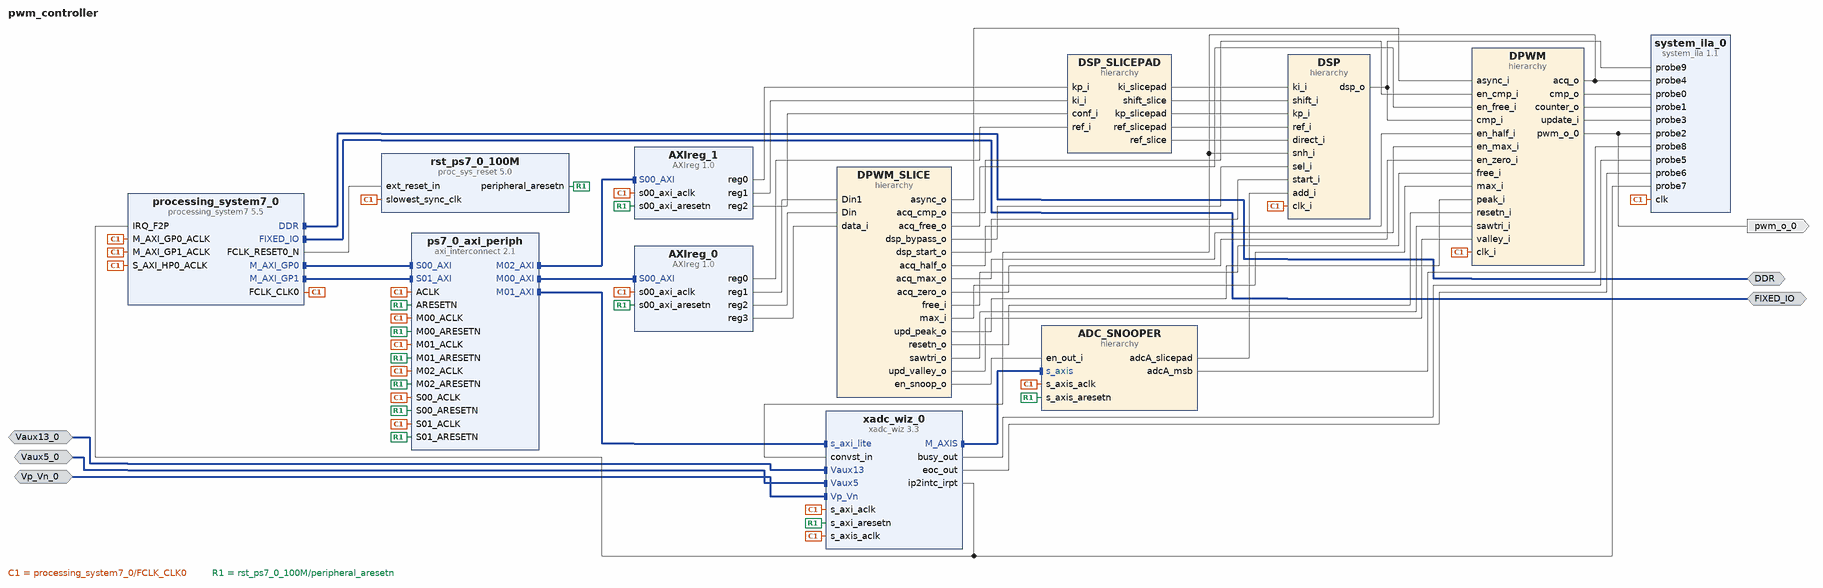
[diagram p0: block diagram of the top level]
# Vivado block design pwm_controller, xc7z020clg400-1, Vivado 2022.2
create_bd_design pwm_controller

create_bd_intf_port -mode Master -vlnv xilinx.com:interface:ddrx_rtl:1.0 DDR
create_bd_intf_port -mode Master -vlnv xilinx.com:display_processing_system7:fixedio_rtl:1.0 FIXED_IO
create_bd_intf_port -mode Slave -vlnv xilinx.com:interface:diff_analog_io_rtl:1.0 Vp_Vn_0
create_bd_intf_port -mode Slave -vlnv xilinx.com:interface:diff_analog_io_rtl:1.0 Vaux5_0
create_bd_intf_port -mode Slave -vlnv xilinx.com:interface:diff_analog_io_rtl:1.0 Vaux13_0
create_bd_port -dir O pwm_o_0

create_bd_cell -type ip -vlnv xilinx.com:ip:processing_system7:5.5 processing_system7_0
set_property -dict [list \
  CONFIG.PCW_APU_PERIPHERAL_FREQMHZ 650 \
  CONFIG.PCW_CRYSTAL_PERIPHERAL_FREQMHZ 50 \
  CONFIG.PCW_ENET0_ENET0_IO {MIO 16 .. 27} \
  CONFIG.PCW_ENET0_GRP_MDIO_ENABLE 1 \
  CONFIG.PCW_ENET0_GRP_MDIO_IO {MIO 52 .. 53} \
  CONFIG.PCW_ENET0_PERIPHERAL_ENABLE 1 \
  CONFIG.PCW_ENET0_RESET_ENABLE 1 \
  CONFIG.PCW_ENET0_RESET_IO {MIO 9} \
  CONFIG.PCW_ENET_RESET_ENABLE 1 \
  CONFIG.PCW_ENET_RESET_SELECT {Share reset pin} \
  CONFIG.PCW_FPGA0_PERIPHERAL_FREQMHZ 100 \
  CONFIG.PCW_FPGA1_PERIPHERAL_FREQMHZ 50 \
  CONFIG.PCW_GPIO_MIO_GPIO_ENABLE 1 \
  CONFIG.PCW_GPIO_MIO_GPIO_IO MIO \
  CONFIG.PCW_I2C_RESET_ENABLE 1 \
  CONFIG.PCW_IRQ_F2P_INTR 1 \
  CONFIG.PCW_M_AXI_GP0_FREQMHZ 10 \
  CONFIG.PCW_PERIPHERAL_BOARD_PRESET part0 \
  CONFIG.PCW_PRESET_BANK1_VOLTAGE {LVCMOS 1.8V} \
  CONFIG.PCW_QSPI_GRP_FBCLK_ENABLE 1 \
  CONFIG.PCW_QSPI_GRP_FBCLK_IO {MIO 8} \
  CONFIG.PCW_QSPI_GRP_SINGLE_SS_ENABLE 1 \
  CONFIG.PCW_QSPI_GRP_SINGLE_SS_IO {MIO 1 .. 6} \
  CONFIG.PCW_QSPI_PERIPHERAL_ENABLE 1 \
  CONFIG.PCW_QSPI_QSPI_IO {MIO 1 .. 6} \
  CONFIG.PCW_SD0_GRP_CD_ENABLE 1 \
  CONFIG.PCW_SD0_GRP_CD_IO {MIO 47} \
  CONFIG.PCW_SD0_GRP_WP_ENABLE 0 \
  CONFIG.PCW_SD0_PERIPHERAL_ENABLE 1 \
  CONFIG.PCW_SD0_SD0_IO {MIO 40 .. 45} \
  CONFIG.PCW_SDIO_PERIPHERAL_FREQMHZ 50 \
  CONFIG.PCW_SINGLE_QSPI_DATA_MODE x4 \
  CONFIG.PCW_S_AXI_HP0_FREQMHZ 10 \
  CONFIG.PCW_UART0_PERIPHERAL_ENABLE 1 \
  CONFIG.PCW_UART0_UART0_IO {MIO 14 .. 15} \
  CONFIG.PCW_UART1_PERIPHERAL_ENABLE 0 \
  CONFIG.PCW_UART_PERIPHERAL_FREQMHZ 100 \
  CONFIG.PCW_UIPARAM_DDR_BUS_WIDTH {16 Bit} \
  CONFIG.PCW_UIPARAM_DDR_FREQ_MHZ 525 \
  CONFIG.PCW_UIPARAM_DDR_PARTNO {MT41J256M16 RE-125} \
  CONFIG.PCW_USB0_PERIPHERAL_ENABLE 1 \
  CONFIG.PCW_USB0_RESET_ENABLE 1 \
  CONFIG.PCW_USB0_RESET_IO {MIO 46} \
  CONFIG.PCW_USB0_USB0_IO {MIO 28 .. 39} \
  CONFIG.PCW_USB_RESET_ENABLE 1 \
  CONFIG.PCW_USB_RESET_SELECT {Share reset pin} \
  CONFIG.PCW_USE_FABRIC_INTERRUPT 1 \
  CONFIG.PCW_USE_M_AXI_GP1 1 \
  CONFIG.PCW_USE_S_AXI_HP0 1 \
] [get_bd_cells processing_system7_0]
# 499 more settings of processing_system7_0 are not shown: defaults, MIO pin electricals, DDR timing, and values the tool derives
create_bd_cell -type ip -vlnv xilinx.com:ip:proc_sys_reset:5.0 rst_ps7_0_100M
create_bd_cell -type ip -vlnv xilinx.com:ip:xadc_wiz:3.3 xadc_wiz_0
set_property -dict [list \
  CONFIG.CHANNEL_ENABLE_VAUXP13_VAUXN13 true \
  CONFIG.CHANNEL_ENABLE_VAUXP5_VAUXN5 true \
  CONFIG.CHANNEL_ENABLE_VP_VN false \
  CONFIG.ENABLE_AXI4STREAM true \
  CONFIG.ENABLE_VCCDDRO_ALARM false \
  CONFIG.ENABLE_VCCPAUX_ALARM false \
  CONFIG.ENABLE_VCCPINT_ALARM false \
  CONFIG.EXTERNAL_MUX_CHANNEL VP_VN \
  CONFIG.OT_ALARM false \
  CONFIG.SEQUENCER_MODE Off \
  CONFIG.SINGLE_CHANNEL_SELECTION TEMPERATURE \
  CONFIG.TIMING_MODE Event \
  CONFIG.USER_TEMP_ALARM false \
  CONFIG.VCCAUX_ALARM false \
  CONFIG.VCCINT_ALARM false \
  CONFIG.XADC_STARUP_SELECTION simultaneous_sampling \
] [get_bd_cells xadc_wiz_0]
create_bd_cell -type ip -vlnv xilinx.com:ip:axi_interconnect:2.1 ps7_0_axi_periph
set_property -dict {CONFIG.NUM_MI 3 CONFIG.NUM_SI 2} [get_bd_cells ps7_0_axi_periph]
create_bd_cell -type ip -vlnv user.org:user:AXIreg:1.0 AXIreg_1
create_bd_cell -type ip -vlnv user.org:user:AXIreg:1.0 AXIreg_0
create_bd_cell -type hier DPWM
create_bd_cell -type hier ADC_SNOOPER
create_bd_cell -type ip -vlnv xilinx.com:ip:system_ila:1.1 system_ila_0
set_property -dict [list \
  CONFIG.ALL_PROBE_SAME_MU true \
  CONFIG.C_ADV_TRIGGER false \
  CONFIG.C_DATA_DEPTH 65536 \
  CONFIG.C_MON_TYPE NATIVE \
  CONFIG.C_NUM_OF_PROBES 10 \
  CONFIG.C_PROBE0_TYPE 0 \
  CONFIG.C_PROBE10_TYPE 0 \
  CONFIG.C_PROBE11_TYPE 0 \
  CONFIG.C_PROBE12_TYPE 0 \
  CONFIG.C_PROBE13_TYPE 0 \
  CONFIG.C_PROBE14_TYPE 0 \
  CONFIG.C_PROBE15_TYPE 0 \
  CONFIG.C_PROBE16_TYPE 0 \
  CONFIG.C_PROBE17_TYPE 0 \
  CONFIG.C_PROBE18_TYPE 0 \
  CONFIG.C_PROBE19_TYPE 0 \
  CONFIG.C_PROBE1_TYPE 0 \
  CONFIG.C_PROBE20_TYPE 0 \
  CONFIG.C_PROBE21_TYPE 0 \
  CONFIG.C_PROBE22_TYPE 0 \
  CONFIG.C_PROBE23_TYPE 0 \
  CONFIG.C_PROBE24_TYPE 0 \
  CONFIG.C_PROBE25_TYPE 0 \
  CONFIG.C_PROBE26_TYPE 0 \
  CONFIG.C_PROBE27_TYPE 0 \
  CONFIG.C_PROBE2_TYPE 0 \
  CONFIG.C_PROBE3_TYPE 0 \
  CONFIG.C_PROBE4_TYPE 0 \
  CONFIG.C_PROBE5_TYPE 0 \
  CONFIG.C_PROBE6_TYPE 0 \
  CONFIG.C_PROBE7_TYPE 0 \
  CONFIG.C_PROBE8_TYPE 0 \
  CONFIG.C_PROBE9_TYPE 0 \
] [get_bd_cells system_ila_0]
create_bd_cell -type hier DPWM_SLICE
create_bd_cell -type hier DSP_SLICEPAD
create_bd_cell -type hier DSP

# ---- hierarchy /DPWM ----
current_bd_instance /DPWM
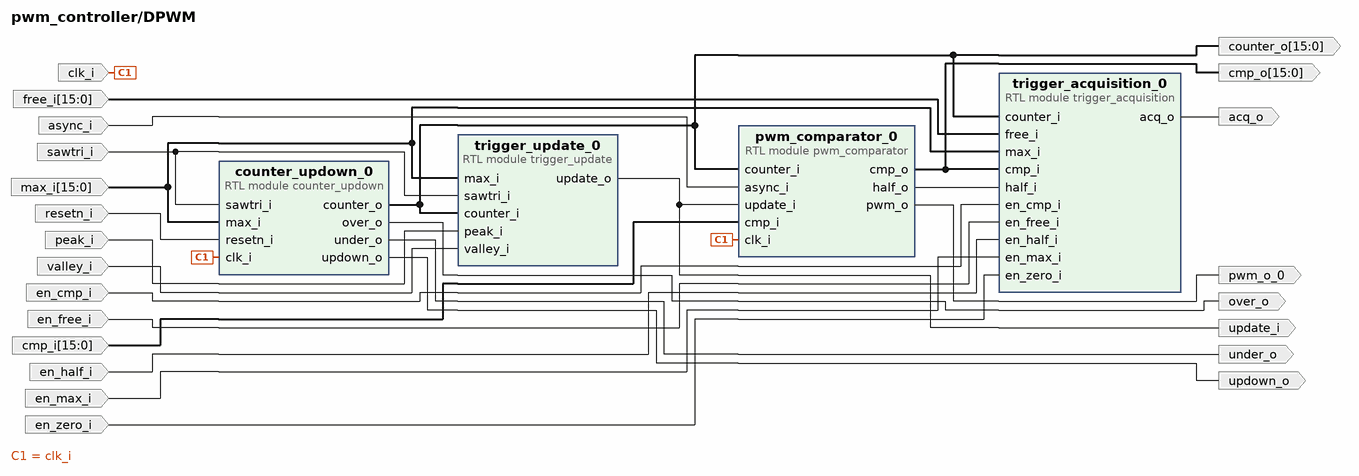
[diagram p1: block diagram inside /DPWM]
create_bd_pin -dir O update_i
create_bd_pin -dir I -from 15 -to 0 max_i
create_bd_pin -dir O -from 15 -to 0 counter_o
create_bd_pin -dir O -from 15 -to 0 cmp_o
create_bd_pin -dir O pwm_o_0
create_bd_pin -dir I -from 15 -to 0 cmp_i
create_bd_pin -dir I clk_i
create_bd_pin -dir O updown_o
create_bd_pin -dir O over_o
create_bd_pin -dir O under_o
create_bd_pin -dir O acq_o
create_bd_pin -dir I -from 15 -to 0 free_i
create_bd_pin -dir I peak_i
create_bd_pin -dir I valley_i
create_bd_pin -dir I async_i
create_bd_pin -dir I sawtri_i
create_bd_pin -dir I resetn_i
create_bd_pin -dir I en_free_i
create_bd_pin -dir I en_max_i
create_bd_pin -dir I en_cmp_i
create_bd_pin -dir I en_half_i
create_bd_pin -dir I en_zero_i

create_bd_cell -type module -reference trigger_update trigger_update_0
create_bd_cell -type module -reference pwm_comparator pwm_comparator_0
create_bd_cell -type module -reference counter_updown counter_updown_0
create_bd_cell -type module -reference trigger_acquisition trigger_acquisition_0

# ---- hierarchy /ADC_SNOOPER ----
current_bd_instance /ADC_SNOOPER
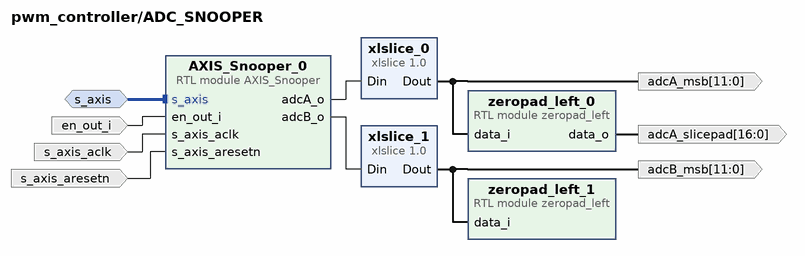
[diagram p2: block diagram inside /ADC_SNOOPER]
create_bd_intf_pin -mode Slave -vlnv xilinx.com:interface:axis_rtl:1.0 s_axis
create_bd_pin -dir O -from 11 -to 0 adcA_msb
create_bd_pin -dir O -from 11 -to 0 adcB_msb
create_bd_pin -dir O -from 16 -to 0 adcA_slicepad
create_bd_pin -dir I -type clk s_axis_aclk
create_bd_pin -dir I -type rst s_axis_aresetn
create_bd_pin -dir I en_out_i

create_bd_cell -type ip -vlnv xilinx.com:ip:xlslice:1.0 xlslice_0
set_property -dict {CONFIG.DIN_FROM 15 CONFIG.DIN_TO 4 CONFIG.DIN_WIDTH 16} [get_bd_cells xlslice_0]
create_bd_cell -type ip -vlnv xilinx.com:ip:xlslice:1.0 xlslice_1
set_property -dict {CONFIG.DIN_FROM 15 CONFIG.DIN_TO 4 CONFIG.DIN_WIDTH 16} [get_bd_cells xlslice_1]
create_bd_cell -type module -reference zeropad_left zeropad_left_1
set_property -dict {CONFIG.INPUT_WIDTH 12 CONFIG.ZEROS 5} [get_bd_cells zeropad_left_1]
create_bd_cell -type module -reference zeropad_left zeropad_left_0
set_property -dict {CONFIG.INPUT_WIDTH 12 CONFIG.ZEROS 5} [get_bd_cells zeropad_left_0]
create_bd_cell -type module -reference AXIS_Snooper AXIS_Snooper_0
set_property -dict {CONFIG.ID_WIDTH 5} [get_bd_cells AXIS_Snooper_0]

# ---- hierarchy /DPWM_SLICE ----
current_bd_instance /DPWM_SLICE
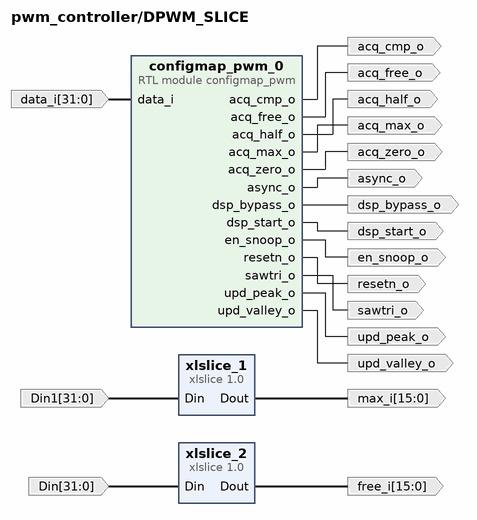
[diagram p3: block diagram inside /DPWM_SLICE]
create_bd_pin -dir I -from 31 -to 0 Din
create_bd_pin -dir O -from 15 -to 0 free_i
create_bd_pin -dir I -from 31 -to 0 Din1
create_bd_pin -dir O -from 15 -to 0 max_i
create_bd_pin -dir O dsp_start_o
create_bd_pin -dir O dsp_bypass_o
create_bd_pin -dir O en_snoop_o
create_bd_pin -dir I -from 31 -to 0 data_i
create_bd_pin -dir O upd_peak_o
create_bd_pin -dir O upd_valley_o
create_bd_pin -dir O async_o
create_bd_pin -dir O sawtri_o
create_bd_pin -dir O resetn_o
create_bd_pin -dir O acq_free_o
create_bd_pin -dir O acq_max_o
create_bd_pin -dir O acq_cmp_o
create_bd_pin -dir O acq_half_o
create_bd_pin -dir O acq_zero_o

create_bd_cell -type ip -vlnv xilinx.com:ip:xlslice:1.0 xlslice_2
set_property -dict {CONFIG.DIN_FROM 15} [get_bd_cells xlslice_2]
create_bd_cell -type ip -vlnv xilinx.com:ip:xlslice:1.0 xlslice_1
set_property -dict {CONFIG.DIN_FROM 15} [get_bd_cells xlslice_1]
create_bd_cell -type module -reference configmap_pwm configmap_pwm_0

# ---- hierarchy /DSP_SLICEPAD ----
current_bd_instance /DSP_SLICEPAD
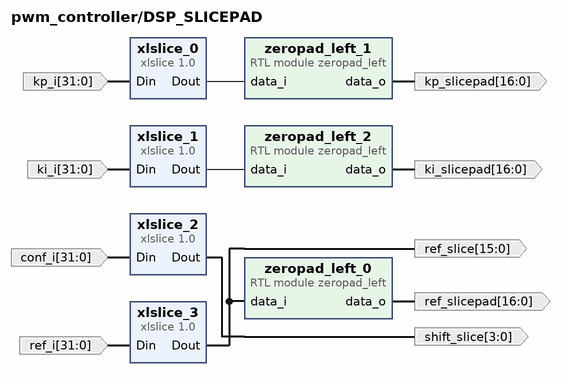
[diagram p4: block diagram inside /DSP_SLICEPAD]
create_bd_pin -dir O -from 16 -to 0 kp_slicepad
create_bd_pin -dir I -from 31 -to 0 kp_i
create_bd_pin -dir O -from 16 -to 0 ref_slicepad
create_bd_pin -dir I -from 31 -to 0 ref_i
create_bd_pin -dir O -from 15 -to 0 ref_slice
create_bd_pin -dir I -from 31 -to 0 ki_i
create_bd_pin -dir O -from 16 -to 0 ki_slicepad
create_bd_pin -dir I -from 31 -to 0 conf_i
create_bd_pin -dir O -from 3 -to 0 shift_slice

create_bd_cell -type ip -vlnv xilinx.com:ip:xlslice:1.0 xlslice_0
set_property -dict {CONFIG.DIN_FROM 15} [get_bd_cells xlslice_0]
create_bd_cell -type module -reference zeropad_left zeropad_left_1
create_bd_cell -type module -reference zeropad_left zeropad_left_0
create_bd_cell -type ip -vlnv xilinx.com:ip:xlslice:1.0 xlslice_3
set_property -dict {CONFIG.DIN_FROM 15} [get_bd_cells xlslice_3]
create_bd_cell -type ip -vlnv xilinx.com:ip:xlslice:1.0 xlslice_1
set_property -dict {CONFIG.DIN_FROM 15} [get_bd_cells xlslice_1]
create_bd_cell -type module -reference zeropad_left zeropad_left_2
create_bd_cell -type ip -vlnv xilinx.com:ip:xlslice:1.0 xlslice_2
set_property -dict {CONFIG.DIN_FROM 31 CONFIG.DIN_TO 28 CONFIG.DOUT_WIDTH 4} [get_bd_cells xlslice_2]

# ---- hierarchy /DSP ----
current_bd_instance /DSP
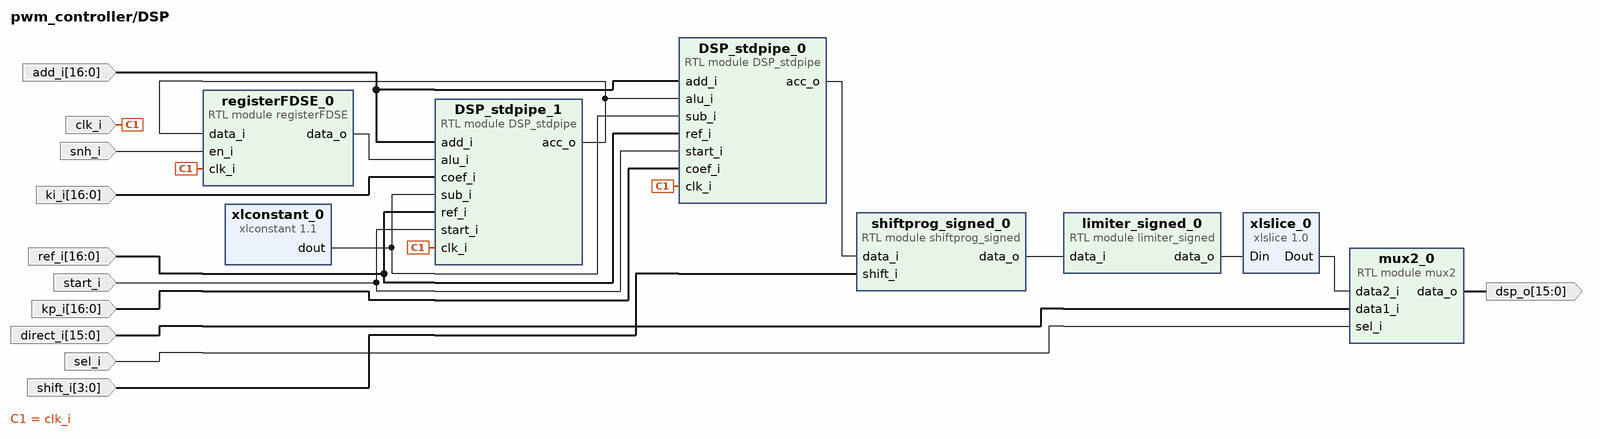
[diagram p5: block diagram inside /DSP]
create_bd_pin -dir I -from 16 -to 0 kp_i
create_bd_pin -dir I -from 16 -to 0 ref_i
create_bd_pin -dir I -from 16 -to 0 add_i
create_bd_pin -dir I start_i
create_bd_pin -dir I clk_i
create_bd_pin -dir O -from 15 -to 0 dsp_o
create_bd_pin -dir I sel_i
create_bd_pin -dir I -from 15 -to 0 direct_i
create_bd_pin -dir I -from 16 -to 0 ki_i
create_bd_pin -dir I -from 3 -to 0 shift_i
create_bd_pin -dir I snh_i

create_bd_cell -type module -reference limiter_signed limiter_signed_0
set_property -dict {CONFIG.DATA_WIDTH 35} [get_bd_cells limiter_signed_0]
create_bd_cell -type module -reference shiftprog_signed shiftprog_signed_0
set_property -dict {CONFIG.DATA_WIDTH 35} [get_bd_cells shiftprog_signed_0]
create_bd_cell -type ip -vlnv xilinx.com:ip:xlslice:1.0 xlslice_0
set_property -dict {CONFIG.DIN_FROM 15 CONFIG.DIN_WIDTH 35} [get_bd_cells xlslice_0]
create_bd_cell -type ip -vlnv xilinx.com:ip:xlconstant:1.1 xlconstant_0
create_bd_cell -type module -reference mux2 mux2_0
create_bd_cell -type module -reference registerFDSE registerFDSE_0
set_property -dict {CONFIG.DATA_WIDTH 35} [get_bd_cells registerFDSE_0]
create_bd_cell -type module -reference DSP_stdpipe DSP_stdpipe_0
create_bd_cell -type module -reference DSP_stdpipe DSP_stdpipe_1

# ---- connections ----

current_bd_instance /DPWM
connect_bd_net -net AXIreg_0_reg2 [get_bd_pins free_i] [get_bd_pins trigger_acquisition_0/free_i]
connect_bd_net [get_bd_pins async_i] [get_bd_pins pwm_comparator_0/async_i]
connect_bd_net -net cmp_o [get_bd_pins pwm_comparator_0/cmp_o] [get_bd_pins cmp_o] [get_bd_pins trigger_acquisition_0/cmp_i]
connect_bd_net -net configmap_pwm_0_sawtri_o [get_bd_pins sawtri_i] [get_bd_pins counter_updown_0/sawtri_i] [get_bd_pins trigger_update_0/sawtri_i]
connect_bd_net -net counter_o [get_bd_pins counter_updown_0/counter_o] \
  [get_bd_pins counter_o] [get_bd_pins pwm_comparator_0/counter_i] [get_bd_pins trigger_acquisition_0/counter_i] \
  [get_bd_pins trigger_update_0/counter_i]
connect_bd_net [get_bd_pins en_cmp_i] [get_bd_pins trigger_acquisition_0/en_cmp_i]
connect_bd_net [get_bd_pins en_free_i] [get_bd_pins trigger_acquisition_0/en_free_i]
connect_bd_net [get_bd_pins en_half_i] [get_bd_pins trigger_acquisition_0/en_half_i]
connect_bd_net [get_bd_pins en_max_i] [get_bd_pins trigger_acquisition_0/en_max_i]
connect_bd_net [get_bd_pins en_zero_i] [get_bd_pins trigger_acquisition_0/en_zero_i]
connect_bd_net -net half_o [get_bd_pins pwm_comparator_0/half_o] [get_bd_pins trigger_acquisition_0/half_i]
connect_bd_net -net limiter_unsigned_3_data_o [get_bd_pins cmp_i] [get_bd_pins pwm_comparator_0/cmp_i]
connect_bd_net [get_bd_pins max_i] [get_bd_pins counter_updown_0/max_i] [get_bd_pins trigger_acquisition_0/max_i] [get_bd_pins trigger_update_0/max_i]
connect_bd_net -net over_o [get_bd_pins counter_updown_0/over_o] [get_bd_pins over_o]
connect_bd_net [get_bd_pins peak_i] [get_bd_pins trigger_update_0/peak_i]
connect_bd_net -net processing_system7_0_FCLK_CLK0 [get_bd_pins clk_i] [get_bd_pins counter_updown_0/clk_i] [get_bd_pins pwm_comparator_0/clk_i]
connect_bd_net -net pwm_o [get_bd_pins pwm_comparator_0/pwm_o] [get_bd_pins pwm_o_0]
connect_bd_net [get_bd_pins resetn_i] [get_bd_pins counter_updown_0/resetn_i]
connect_bd_net -net trigger_acquisition_0_acq_o [get_bd_pins trigger_acquisition_0/acq_o] [get_bd_pins acq_o]
connect_bd_net -net trigger_update_0_update_o [get_bd_pins trigger_update_0/update_o] [get_bd_pins update_i] [get_bd_pins pwm_comparator_0/update_i]
connect_bd_net -net under_o [get_bd_pins counter_updown_0/under_o] [get_bd_pins under_o]
connect_bd_net -net updown_o [get_bd_pins counter_updown_0/updown_o] [get_bd_pins updown_o]
connect_bd_net [get_bd_pins valley_i] [get_bd_pins trigger_update_0/valley_i]
set_property HDL_ATTRIBUTE.DEBUG true [get_bd_nets cmp_o]
set_property HDL_ATTRIBUTE.DEBUG true [get_bd_nets counter_o]
set_property HDL_ATTRIBUTE.DEBUG true [get_bd_nets limiter_unsigned_3_data_o]
set_property HDL_ATTRIBUTE.DEBUG true [get_bd_nets pwm_o]
set_property HDL_ATTRIBUTE.DEBUG true [get_bd_nets trigger_acquisition_0_acq_o]
set_property HDL_ATTRIBUTE.DEBUG true [get_bd_nets trigger_update_0_update_o]

current_bd_instance /ADC_SNOOPER
connect_bd_intf_net [get_bd_intf_pins s_axis] [get_bd_intf_pins AXIS_Snooper_0/s_axis]
connect_bd_net -net ADC_SLICEPAD_data_o [get_bd_pins zeropad_left_0/data_o] [get_bd_pins adcA_slicepad]
connect_bd_net [get_bd_pins AXIS_Snooper_0/adcA_o] [get_bd_pins xlslice_0/Din]
connect_bd_net [get_bd_pins AXIS_Snooper_0/adcB_o] [get_bd_pins xlslice_1/Din]
connect_bd_net -net Dout [get_bd_pins xlslice_0/Dout] [get_bd_pins adcA_msb] [get_bd_pins zeropad_left_0/data_i]
connect_bd_net -net Dout_1 [get_bd_pins xlslice_1/Dout] [get_bd_pins adcB_msb] [get_bd_pins zeropad_left_1/data_i]
connect_bd_net [get_bd_pins en_out_i] [get_bd_pins AXIS_Snooper_0/en_out_i]
connect_bd_net [get_bd_pins s_axis_aclk] [get_bd_pins AXIS_Snooper_0/s_axis_aclk]
connect_bd_net [get_bd_pins s_axis_aresetn] [get_bd_pins AXIS_Snooper_0/s_axis_aresetn]
set_property HDL_ATTRIBUTE.DEBUG true [get_bd_nets Dout]

current_bd_instance /DPWM_SLICE
connect_bd_net -net AXIreg_0_reg1 [get_bd_pins Din1] [get_bd_pins xlslice_1/Din]
connect_bd_net -net AXIreg_0_reg2 [get_bd_pins Din] [get_bd_pins xlslice_2/Din]
connect_bd_net [get_bd_pins configmap_pwm_0/acq_cmp_o] [get_bd_pins acq_cmp_o]
connect_bd_net [get_bd_pins configmap_pwm_0/acq_free_o] [get_bd_pins acq_free_o]
connect_bd_net [get_bd_pins configmap_pwm_0/acq_half_o] [get_bd_pins acq_half_o]
connect_bd_net [get_bd_pins configmap_pwm_0/acq_max_o] [get_bd_pins acq_max_o]
connect_bd_net [get_bd_pins configmap_pwm_0/acq_zero_o] [get_bd_pins acq_zero_o]
connect_bd_net [get_bd_pins configmap_pwm_0/async_o] [get_bd_pins async_o]
connect_bd_net [get_bd_pins configmap_pwm_0/dsp_bypass_o] [get_bd_pins dsp_bypass_o]
connect_bd_net [get_bd_pins configmap_pwm_0/dsp_start_o] [get_bd_pins dsp_start_o]
connect_bd_net [get_bd_pins configmap_pwm_0/en_snoop_o] [get_bd_pins en_snoop_o]
connect_bd_net [get_bd_pins configmap_pwm_0/resetn_o] [get_bd_pins resetn_o]
connect_bd_net [get_bd_pins configmap_pwm_0/sawtri_o] [get_bd_pins sawtri_o]
connect_bd_net [get_bd_pins configmap_pwm_0/upd_peak_o] [get_bd_pins upd_peak_o]
connect_bd_net [get_bd_pins configmap_pwm_0/upd_valley_o] [get_bd_pins upd_valley_o]
connect_bd_net [get_bd_pins data_i] [get_bd_pins configmap_pwm_0/data_i]
connect_bd_net -net free_i [get_bd_pins xlslice_2/Dout] [get_bd_pins free_i]
connect_bd_net -net max_i [get_bd_pins xlslice_1/Dout] [get_bd_pins max_i]

current_bd_instance /DSP_SLICEPAD
connect_bd_net -net AXIreg_1_reg0 [get_bd_pins kp_i] [get_bd_pins xlslice_0/Din]
connect_bd_net -net Din1_1 [get_bd_pins conf_i] [get_bd_pins xlslice_2/Din]
connect_bd_net -net Din_1 [get_bd_pins ref_i] [get_bd_pins xlslice_3/Din]
connect_bd_net -net Din_2 [get_bd_pins ki_i] [get_bd_pins xlslice_1/Din]
connect_bd_net [get_bd_pins xlslice_0/Dout] [get_bd_pins zeropad_left_1/data_i]
connect_bd_net [get_bd_pins xlslice_1/Dout] [get_bd_pins zeropad_left_2/data_i]
connect_bd_net [get_bd_pins xlslice_2/Dout] [get_bd_pins shift_slice]
connect_bd_net [get_bd_pins xlslice_3/Dout] [get_bd_pins zeropad_left_0/data_i] [get_bd_pins ref_slice]
connect_bd_net [get_bd_pins zeropad_left_0/data_o] [get_bd_pins ref_slicepad]
connect_bd_net [get_bd_pins zeropad_left_1/data_o] [get_bd_pins kp_slicepad]
connect_bd_net [get_bd_pins zeropad_left_2/data_o] [get_bd_pins ki_slicepad]

current_bd_instance /DSP
connect_bd_net -net ADC_SLICEPAD_data_o [get_bd_pins add_i] [get_bd_pins DSP_stdpipe_0/add_i] [get_bd_pins DSP_stdpipe_1/add_i]
connect_bd_net -net DSP_SLICEPAD_coef_slicepad [get_bd_pins kp_i] [get_bd_pins DSP_stdpipe_0/coef_i]
connect_bd_net -net DSP_SLICEPAD_data_o [get_bd_pins ref_i] [get_bd_pins DSP_stdpipe_0/ref_i] [get_bd_pins DSP_stdpipe_1/ref_i]
connect_bd_net [get_bd_pins DSP_stdpipe_0/acc_o] [get_bd_pins shiftprog_signed_0/data_i]
connect_bd_net [get_bd_pins DSP_stdpipe_1/acc_o] [get_bd_pins registerFDSE_0/data_i] [get_bd_pins DSP_stdpipe_0/alu_i]
connect_bd_net -net coef_i_1 [get_bd_pins ki_i] [get_bd_pins DSP_stdpipe_1/coef_i]
connect_bd_net -net configmap_pwm_0_dsp_start_o [get_bd_pins start_i] [get_bd_pins DSP_stdpipe_0/start_i] [get_bd_pins DSP_stdpipe_1/start_i]
connect_bd_net -net data1_i_1 [get_bd_pins direct_i] [get_bd_pins mux2_0/data1_i]
connect_bd_net -net en_i_1 [get_bd_pins snh_i] [get_bd_pins registerFDSE_0/en_i]
connect_bd_net [get_bd_pins limiter_signed_0/data_o] [get_bd_pins xlslice_0/Din]
connect_bd_net -net mux2_0_data_o [get_bd_pins mux2_0/data_o] [get_bd_pins dsp_o]
connect_bd_net -net processing_system7_0_FCLK_CLK0 [get_bd_pins clk_i] \
  [get_bd_pins registerFDSE_0/clk_i] [get_bd_pins DSP_stdpipe_0/clk_i] [get_bd_pins DSP_stdpipe_1/clk_i]
connect_bd_net [get_bd_pins registerFDSE_0/data_o] [get_bd_pins DSP_stdpipe_1/alu_i]
connect_bd_net [get_bd_pins sel_i] [get_bd_pins mux2_0/sel_i]
connect_bd_net [get_bd_pins shift_i] [get_bd_pins shiftprog_signed_0/shift_i]
connect_bd_net [get_bd_pins shiftprog_signed_0/data_o] [get_bd_pins limiter_signed_0/data_i]
connect_bd_net [get_bd_pins xlconstant_0/dout] [get_bd_pins DSP_stdpipe_0/sub_i] [get_bd_pins DSP_stdpipe_1/sub_i]
connect_bd_net [get_bd_pins xlslice_0/Dout] [get_bd_pins mux2_0/data2_i]
set_property HDL_ATTRIBUTE.DEBUG true [get_bd_nets en_i_1]
set_property HDL_ATTRIBUTE.DEBUG true [get_bd_nets mux2_0_data_o]

current_bd_instance /
connect_bd_intf_net -intf_net Vaux13_0_1 [get_bd_intf_ports Vaux13_0] [get_bd_intf_pins xadc_wiz_0/Vaux13]
connect_bd_intf_net -intf_net Vaux5_0_1 [get_bd_intf_ports Vaux5_0] [get_bd_intf_pins xadc_wiz_0/Vaux5]
connect_bd_intf_net -intf_net Vp_Vn_0_1 [get_bd_intf_ports Vp_Vn_0] [get_bd_intf_pins xadc_wiz_0/Vp_Vn]
connect_bd_intf_net [get_bd_intf_ports DDR] [get_bd_intf_pins processing_system7_0/DDR]
connect_bd_intf_net [get_bd_intf_ports FIXED_IO] [get_bd_intf_pins processing_system7_0/FIXED_IO]
connect_bd_intf_net [get_bd_intf_pins processing_system7_0/M_AXI_GP0] [get_bd_intf_pins ps7_0_axi_periph/S00_AXI]
connect_bd_intf_net [get_bd_intf_pins processing_system7_0/M_AXI_GP1] [get_bd_intf_pins ps7_0_axi_periph/S01_AXI]
connect_bd_intf_net [get_bd_intf_pins ps7_0_axi_periph/M00_AXI] [get_bd_intf_pins AXIreg_0/S00_AXI]
connect_bd_intf_net [get_bd_intf_pins ps7_0_axi_periph/M01_AXI] [get_bd_intf_pins xadc_wiz_0/s_axi_lite]
connect_bd_intf_net [get_bd_intf_pins ps7_0_axi_periph/M02_AXI] [get_bd_intf_pins AXIreg_1/S00_AXI]
connect_bd_intf_net [get_bd_intf_pins xadc_wiz_0/M_AXIS] [get_bd_intf_pins ADC_SNOOPER/s_axis]
connect_bd_net -net ADC_SLICEPAD_data_o [get_bd_pins ADC_SNOOPER/adcA_slicepad] [get_bd_pins DSP/add_i]
connect_bd_net [get_bd_pins AXIreg_0/reg0] [get_bd_pins DSP_SLICEPAD/ref_i]
connect_bd_net [get_bd_pins AXIreg_0/reg1] [get_bd_pins DPWM_SLICE/Din1]
connect_bd_net [get_bd_pins AXIreg_0/reg2] [get_bd_pins DPWM_SLICE/Din]
connect_bd_net [get_bd_pins AXIreg_0/reg3] [get_bd_pins DPWM_SLICE/data_i]
connect_bd_net [get_bd_pins AXIreg_1/reg0] [get_bd_pins DSP_SLICEPAD/kp_i]
connect_bd_net [get_bd_pins AXIreg_1/reg1] [get_bd_pins DSP_SLICEPAD/ki_i]
connect_bd_net [get_bd_pins AXIreg_1/reg2] [get_bd_pins DSP_SLICEPAD/conf_i]
connect_bd_net [get_bd_pins DPWM_SLICE/en_snoop_o] [get_bd_pins ADC_SNOOPER/en_out_i]
connect_bd_net -net DSP_SLICEPAD_Dout [get_bd_pins DSP_SLICEPAD/ki_slicepad] [get_bd_pins DSP/ki_i]
connect_bd_net -net DSP_SLICEPAD_Dout1 [get_bd_pins DSP_SLICEPAD/shift_slice] [get_bd_pins DSP/shift_i]
connect_bd_net -net DSP_SLICEPAD_coef_slicepad [get_bd_pins DSP_SLICEPAD/kp_slicepad] [get_bd_pins DSP/kp_i]
connect_bd_net -net DSP_SLICEPAD_data_o [get_bd_pins DSP_SLICEPAD/ref_slicepad] [get_bd_pins DSP/ref_i]
connect_bd_net -net acq_o [get_bd_pins DPWM/acq_o] [get_bd_pins xadc_wiz_0/convst_in] [get_bd_pins system_ila_0/probe4] [get_bd_pins DSP/snh_i]
connect_bd_net -net adcA [get_bd_pins ADC_SNOOPER/adcA_msb] [get_bd_pins system_ila_0/probe8]
connect_bd_net -net async_i_1 [get_bd_pins DPWM_SLICE/async_o] [get_bd_pins DPWM/async_i]
connect_bd_net -net busy_out [get_bd_pins xadc_wiz_0/busy_out] [get_bd_pins system_ila_0/probe5]
connect_bd_net -net cmp_o [get_bd_pins DPWM/cmp_o] [get_bd_pins system_ila_0/probe0]
connect_bd_net -net counter_o [get_bd_pins DPWM/counter_o] [get_bd_pins system_ila_0/probe1]
# net counter_out has one end: 
connect_bd_net -net data1_i_1 [get_bd_pins DSP_SLICEPAD/ref_slice] [get_bd_pins DSP/direct_i]
connect_bd_net -net dsp_o [get_bd_pins DSP/dsp_o] [get_bd_pins DPWM/cmp_i] [get_bd_pins system_ila_0/probe9]
connect_bd_net -net en_cmp_i_1 [get_bd_pins DPWM_SLICE/acq_cmp_o] [get_bd_pins DPWM/en_cmp_i]
connect_bd_net -net en_free_i_1 [get_bd_pins DPWM_SLICE/acq_free_o] [get_bd_pins DPWM/en_free_i]
connect_bd_net -net en_half_i_1 [get_bd_pins DPWM_SLICE/acq_half_o] [get_bd_pins DPWM/en_half_i]
connect_bd_net -net en_max_i_1 [get_bd_pins DPWM_SLICE/acq_max_o] [get_bd_pins DPWM/en_max_i]
connect_bd_net -net en_zero_i_1 [get_bd_pins DPWM_SLICE/acq_zero_o] [get_bd_pins DPWM/en_zero_i]
connect_bd_net -net eoc_out [get_bd_pins xadc_wiz_0/eoc_out] [get_bd_pins system_ila_0/probe6]
connect_bd_net -net free_i [get_bd_pins DPWM_SLICE/free_i] [get_bd_pins DPWM/free_i]
connect_bd_net -net ip2intc_irpt [get_bd_pins xadc_wiz_0/ip2intc_irpt] [get_bd_pins processing_system7_0/IRQ_F2P] [get_bd_pins system_ila_0/probe7]
connect_bd_net -net max_i [get_bd_pins DPWM_SLICE/max_i] [get_bd_pins DPWM/max_i]
# net over_out has one end: 
connect_bd_net -net peak_i_1 [get_bd_pins DPWM_SLICE/upd_peak_o] [get_bd_pins DPWM/peak_i]
connect_bd_net [get_bd_pins processing_system7_0/FCLK_CLK0] \
  [get_bd_pins processing_system7_0/M_AXI_GP0_ACLK] [get_bd_pins rst_ps7_0_100M/slowest_sync_clk] \
  [get_bd_pins processing_system7_0/M_AXI_GP1_ACLK] [get_bd_pins xadc_wiz_0/s_axi_aclk] [get_bd_pins ps7_0_axi_periph/ACLK] \
  [get_bd_pins ps7_0_axi_periph/M01_ACLK] [get_bd_pins ps7_0_axi_periph/S01_ACLK] [get_bd_pins ps7_0_axi_periph/M00_ACLK] \
  [get_bd_pins ps7_0_axi_periph/S00_ACLK] [get_bd_pins processing_system7_0/S_AXI_HP0_ACLK] \
  [get_bd_pins xadc_wiz_0/s_axis_aclk] [get_bd_pins ps7_0_axi_periph/M02_ACLK] [get_bd_pins AXIreg_1/s00_axi_aclk] \
  [get_bd_pins AXIreg_0/s00_axi_aclk] [get_bd_pins DPWM/clk_i] [get_bd_pins system_ila_0/clk] [get_bd_pins DSP/clk_i] \
  [get_bd_pins ADC_SNOOPER/s_axis_aclk]
connect_bd_net [get_bd_pins processing_system7_0/FCLK_RESET0_N] [get_bd_pins rst_ps7_0_100M/ext_reset_in]
connect_bd_net -net pwm_o [get_bd_pins DPWM/pwm_o_0] [get_bd_ports pwm_o_0] [get_bd_pins system_ila_0/probe2]
connect_bd_net -net resetn_i_1 [get_bd_pins DPWM_SLICE/resetn_o] [get_bd_pins DPWM/resetn_i]
connect_bd_net [get_bd_pins rst_ps7_0_100M/peripheral_aresetn] \
  [get_bd_pins xadc_wiz_0/s_axi_aresetn] [get_bd_pins ps7_0_axi_periph/ARESETN] [get_bd_pins ps7_0_axi_periph/M01_ARESETN] \
  [get_bd_pins ps7_0_axi_periph/S01_ARESETN] [get_bd_pins ps7_0_axi_periph/M00_ARESETN] \
  [get_bd_pins ps7_0_axi_periph/S00_ARESETN] [get_bd_pins ps7_0_axi_periph/M02_ARESETN] \
  [get_bd_pins AXIreg_1/s00_axi_aresetn] [get_bd_pins AXIreg_0/s00_axi_aresetn] [get_bd_pins ADC_SNOOPER/s_axis_aresetn]
connect_bd_net -net sawtri_i_1 [get_bd_pins DPWM_SLICE/sawtri_o] [get_bd_pins DPWM/sawtri_i]
connect_bd_net -net sel_i_1 [get_bd_pins DPWM_SLICE/dsp_bypass_o] [get_bd_pins DSP/sel_i]
# net shifted_d has one end: 
connect_bd_net -net start_i_1 [get_bd_pins DPWM_SLICE/dsp_start_o] [get_bd_pins DSP/start_i]
# net trunc_d has one end: 
# net under_out has one end: 
connect_bd_net -net update_o [get_bd_pins DPWM/update_i] [get_bd_pins system_ila_0/probe3]
# net updown_out has one end: 
connect_bd_net -net valley_i_1 [get_bd_pins DPWM_SLICE/upd_valley_o] [get_bd_pins DPWM/valley_i]
set_property HDL_ATTRIBUTE.DEBUG true [get_bd_nets acq_o]
set_property HDL_ATTRIBUTE.MARK_DEBUG true [get_bd_nets acq_o]
set_property HDL_ATTRIBUTE.DEBUG true [get_bd_nets adcA]
set_property HDL_ATTRIBUTE.MARK_DEBUG true [get_bd_nets adcA]
set_property HDL_ATTRIBUTE.DEBUG true [get_bd_nets busy_out]
set_property HDL_ATTRIBUTE.MARK_DEBUG true [get_bd_nets busy_out]
set_property HDL_ATTRIBUTE.DEBUG true [get_bd_nets cmp_o]
set_property HDL_ATTRIBUTE.MARK_DEBUG true [get_bd_nets cmp_o]
set_property HDL_ATTRIBUTE.DEBUG true [get_bd_nets counter_o]
set_property HDL_ATTRIBUTE.MARK_DEBUG true [get_bd_nets counter_o]
set_property HDL_ATTRIBUTE.DEBUG true [get_bd_nets counter_out]
set_property HDL_ATTRIBUTE.MARK_DEBUG true [get_bd_nets counter_out]
set_property HDL_ATTRIBUTE.DEBUG true [get_bd_nets dsp_o]
set_property HDL_ATTRIBUTE.MARK_DEBUG true [get_bd_nets dsp_o]
set_property HDL_ATTRIBUTE.DEBUG true [get_bd_nets eoc_out]
set_property HDL_ATTRIBUTE.MARK_DEBUG true [get_bd_nets eoc_out]
set_property HDL_ATTRIBUTE.DEBUG true [get_bd_nets ip2intc_irpt]
set_property HDL_ATTRIBUTE.MARK_DEBUG true [get_bd_nets ip2intc_irpt]
set_property HDL_ATTRIBUTE.DEBUG true [get_bd_nets over_out]
set_property HDL_ATTRIBUTE.MARK_DEBUG true [get_bd_nets over_out]
set_property HDL_ATTRIBUTE.DEBUG true [get_bd_nets pwm_o]
set_property HDL_ATTRIBUTE.MARK_DEBUG true [get_bd_nets pwm_o]
set_property HDL_ATTRIBUTE.DEBUG true [get_bd_nets shifted_d]
set_property HDL_ATTRIBUTE.MARK_DEBUG true [get_bd_nets shifted_d]
set_property HDL_ATTRIBUTE.DEBUG true [get_bd_nets trunc_d]
set_property HDL_ATTRIBUTE.MARK_DEBUG true [get_bd_nets trunc_d]
set_property HDL_ATTRIBUTE.DEBUG true [get_bd_nets under_out]
set_property HDL_ATTRIBUTE.MARK_DEBUG true [get_bd_nets under_out]
set_property HDL_ATTRIBUTE.DEBUG true [get_bd_nets update_o]
set_property HDL_ATTRIBUTE.MARK_DEBUG true [get_bd_nets update_o]
set_property HDL_ATTRIBUTE.DEBUG true [get_bd_nets updown_out]
set_property HDL_ATTRIBUTE.MARK_DEBUG true [get_bd_nets updown_out]

# ---- address map ----
assign_bd_address -offset 0x40000000 -range 64K -target_address_space [get_bd_addr_spaces processing_system7_0/Data] [get_bd_addr_segs AXIreg_0/S00_AXI/S00_AXI_reg]
assign_bd_address -offset 0x40010000 -range 64K -target_address_space [get_bd_addr_spaces processing_system7_0/Data] [get_bd_addr_segs AXIreg_1/S00_AXI/S00_AXI_reg]
assign_bd_address -offset 0x7FFF8000 -range 32K -target_address_space [get_bd_addr_spaces processing_system7_0/Data] [get_bd_addr_segs xadc_wiz_0/s_axi_lite/Reg]
assign_bd_address -offset 0x80000000 -range 32K -target_address_space [get_bd_addr_spaces processing_system7_0/Data] [get_bd_addr_segs xadc_wiz_0/s_axi_lite/Reg]

validate_bd_design
save_bd_design
